# EAGLE schematic Tyr V4 (EAGLE 9.5.1)

## Sheet 1 of 3
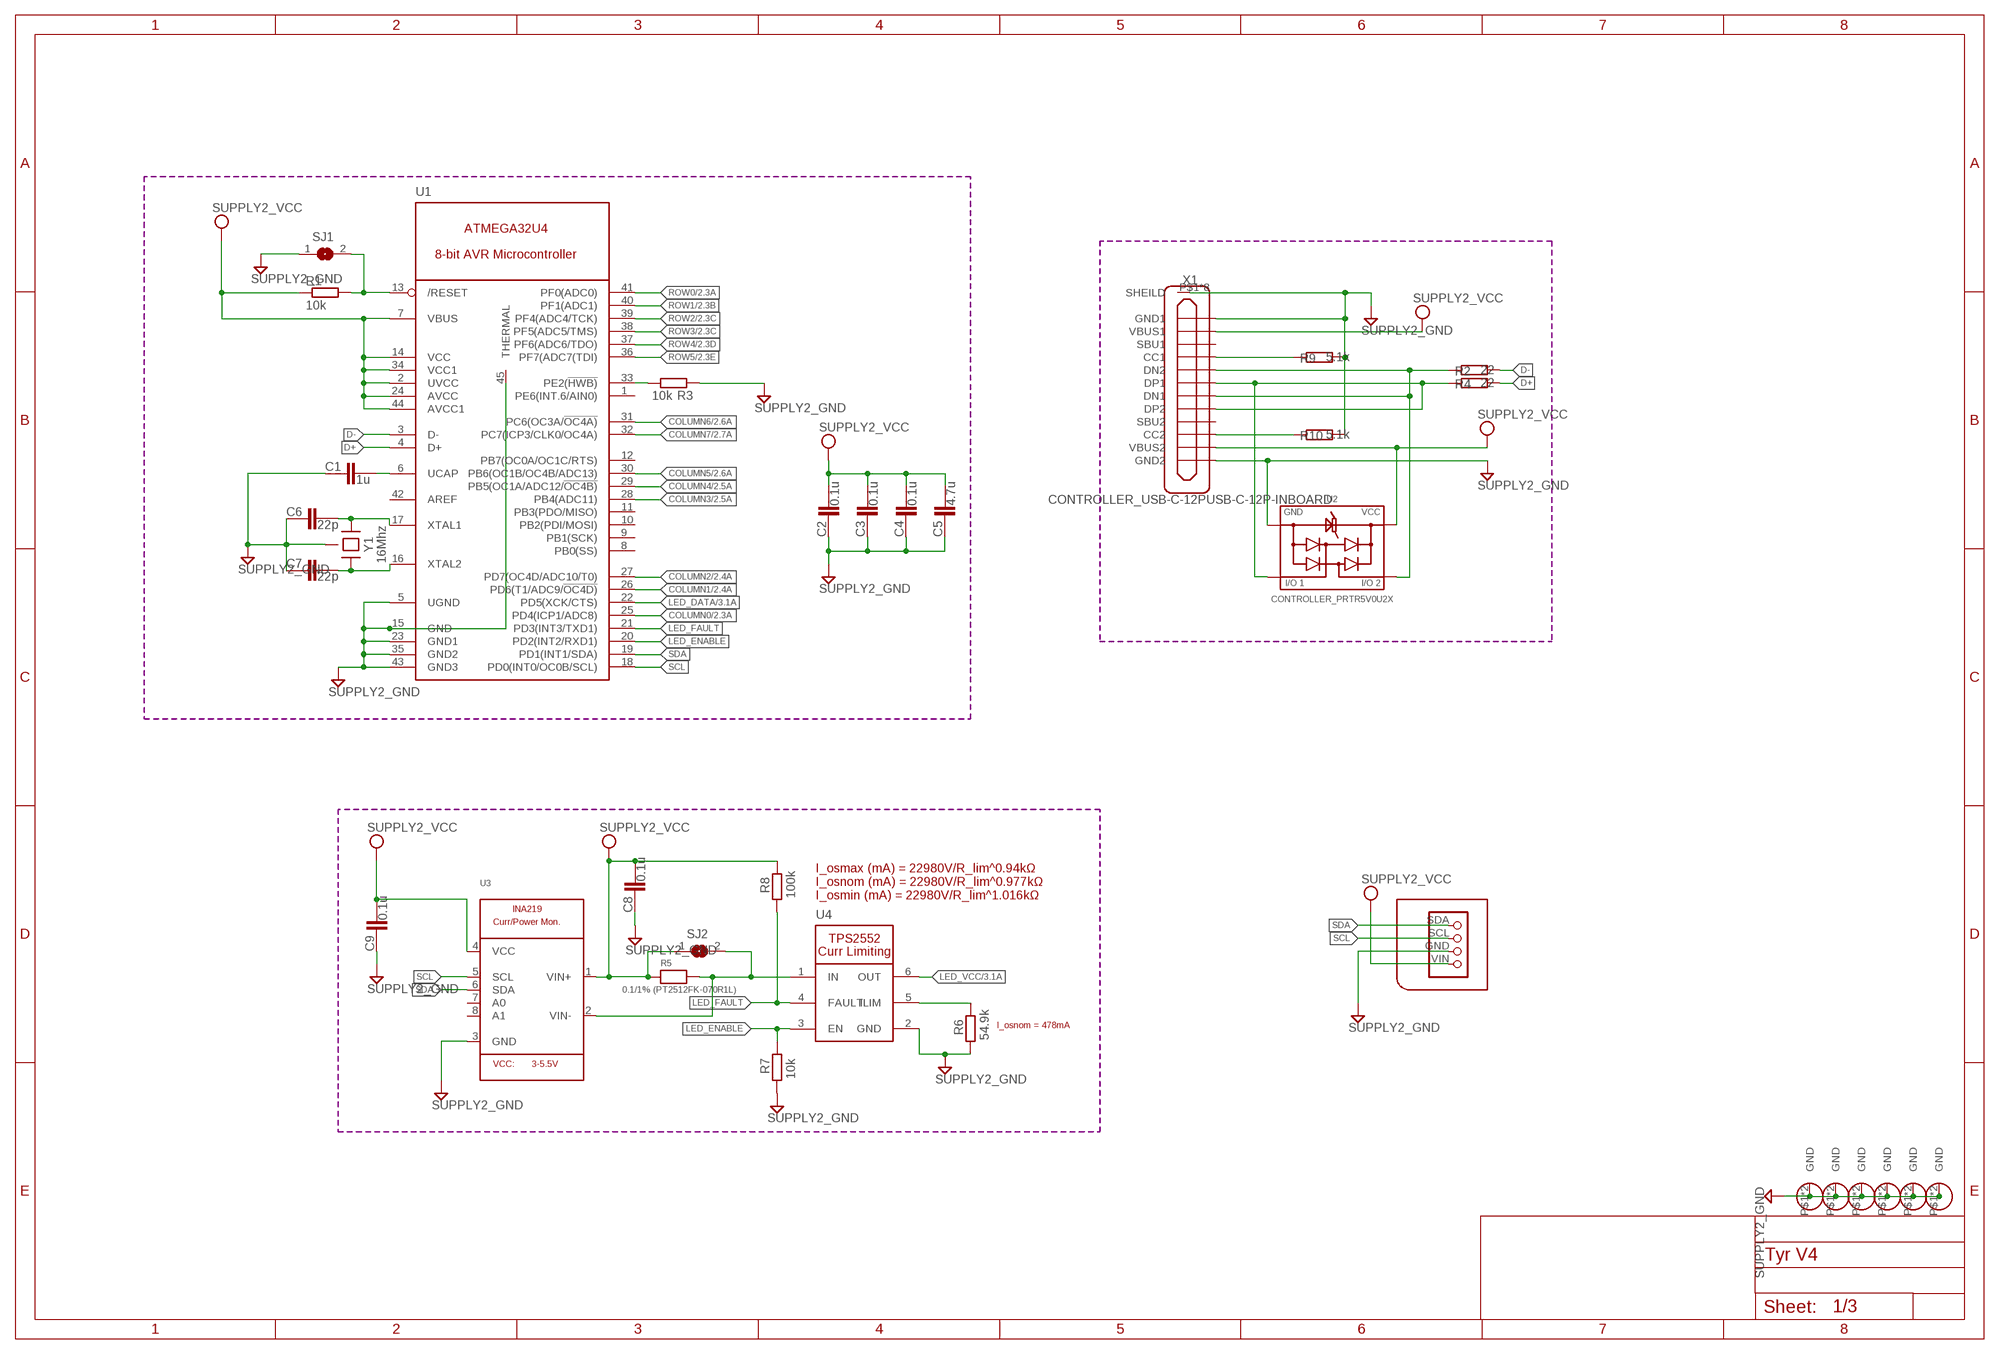
[diagram p0: schematic, sheet 1]

### Parts
C1  1u  COMPONENTS_CAPACITOR-0603  [COMPONENTS_C0603]
C2  0.1u  COMPONENTS_CAPACITOR-0603  [COMPONENTS_C0603]
C3  0.1u  COMPONENTS_CAPACITOR-0603  [COMPONENTS_C0603]
C4  0.1u  COMPONENTS_CAPACITOR-0603  [COMPONENTS_C0603]
C5  4.7u  COMPONENTS_CAPACITOR-0603  [COMPONENTS_C0603]
C6  22p  COMPONENTS_CAPACITOR-0603  [COMPONENTS_C0603]
C7  22p  COMPONENTS_CAPACITOR-0603  [COMPONENTS_C0603]
C8  0.1u  COMPONENTS_CAPACITOR-0603  [COMPONENTS_C0603]
C9  0.1u  COMPONENTS_CAPACITOR-0603  [COMPONENTS_C0603]
HOLE1  HOLE_MOUNT_HOLE  [HOLE_M3_OVAL]
HOLE2  HOLE_MOUNT_HOLE  [HOLE_M3_OVAL]
HOLE3  HOLE_MOUNT_HOLE  [HOLE_M3_OVAL]
HOLE4  HOLE_MOUNT_HOLE  [HOLE_M3_OVAL]
HOLE5  HOLE_MOUNT_HOLE  [HOLE_M3_OVAL]
HOLE6  HOLE_MOUNT_HOLE  [HOLE_M3_OVAL]
J1  TYR_TYR_DISPLAY  [TYR_TYR_DISPLAY]
R1  10k  COMPONENTS_RESISTOR-0603  [COMPONENTS_R0603]
R2  22  COMPONENTS_RESISTOR-0603  [COMPONENTS_R0603]
R3  10k  COMPONENTS_RESISTOR-0603  [COMPONENTS_R0603]
R4  22  COMPONENTS_RESISTOR-0603  [COMPONENTS_R0603]
R5  0.1/1% (PT2512FK-070R1L)  MICROBUILDER_RESISTOR2512  [MICROBUILDER_2512]
R6  54.9k  COMPONENTS_RESISTOR-0603  [COMPONENTS_R0603]
R7  10k  COMPONENTS_RESISTOR-0603  [COMPONENTS_R0603]
R8  100k  COMPONENTS_RESISTOR-0603  [COMPONENTS_R0603]
R9  5.1k  COMPONENTS_RESISTOR-0603  [COMPONENTS_R0603]
R10  5.1k  COMPONENTS_RESISTOR-0603  [COMPONENTS_R0603]
SJ1  MICROBUILDER_SOLDERJUMPER  [MICROBUILDER_SOLDERJUMPER_ARROW_NOPASTE]
SJ2  MICROBUILDER_SOLDERJUMPER  [MICROBUILDER_SOLDERJUMPER_ARROW_NOPASTE]
U1  TYR_ATMEGA32U4  [TYR_QFN44-7X7]
U2  CONTROLLER_PRTR5V0U2X  [CONTROLLER_PRTR5V0U2X]
U3  MICROBUILDER_INA219  [MICROBUILDER_SOT23-8]
U4  TYR_TPS2552  [TYR_SOT-23-6P]
X1  CONTROLLER_USB-C-12PUSB-C-12P-INBOARD  [CONTROLLER_USB-C-12P-INBOARD]
Y1  16Mhz  CONTROLLER_CRYSTAL-4PIN-3.2X2.5  [CONTROLLER_CRYSTAL-3.2X2.5]

### Nets
COLUMN0: U1.25(PD4(ICP1/ADC8)) ; also sheet 2
COLUMN1: U1.26(PD6(T1/ADC9/!OC4D)) ; also sheet 2
COLUMN2: U1.27(PD7(OC4D/ADC10/T0)) ; also sheet 2
COLUMN3: U1.28(PB4(ADC11)) ; also sheet 2
COLUMN4: U1.29(PB5(OC1A/ADC12/!OC4B)) ; also sheet 2
COLUMN5: U1.30(PB6(OC1B/OC4B/ADC13)) ; also sheet 2
COLUMN6: U1.31(PC6(OC3A/!OC4A)) ; also sheet 2
COLUMN7: U1.32(PC7(ICP3/CLK0/OC4A)) ; also sheet 2
D+: R4.2 U1.4(D+)
D-: R2.2 U1.3(D-)
GND: C1.1 C2.1 C3.1 C4.1 C5.1 C6.1 C7.1 C8.1 C9.1 HOLE1.P$1(GND) HOLE1.P$2(GND) HOLE2.P$1(GND) HOLE2.P$2(GND) HOLE3.P$1(GND) HOLE3.P$2(GND) HOLE4.P$1(GND) HOLE4.P$2(GND) HOLE5.P$1(GND) HOLE5.P$2(GND) HOLE6.P$1(GND) HOLE6.P$2(GND) J1.GND R3.1 R6.1 R7.1 R9.2 R10.2 SJ1.1 U1.5(UGND) U1.15(GND) U1.23(GND1) U1.35(GND2) U1.43(GND3) U1.45(THERMAL) U2.1 U3.3(GND) U4.2(GND) X1.GND1 X1.GND2 X1.P$1(SHEILD) X1.P$2(SHEILD) X1.P$3(SHEILD) X1.P$4(SHEILD) X1.P$5(SHEILD) X1.P$6(SHEILD) X1.P$8(SHEILD) X1.P$9(SHEILD) Y1.2(GND) Y1.4(GND) ; supply symbol labelled SUPPLY2_GND ; also sheet 2,3
LED_DATA: U1.22(PD5(XCK/CTS)) ; also sheet 3
LED_ENABLE: R7.2 U1.20(PD2(INT2/RXD1)) U4.3(EN)
LED_FAULT: R8.1 U1.21(PD3(INT3/TXD1)) U4.4(FAULT)
LED_VCC: U4.6(OUT) ; also sheet 3
N$2: R5.2 SJ2.2 U3.2(VIN-) U4.1(IN)
N$3: R6.2 U4.5(ILIM)
N$4: R9.1 X1.CC1
N$5: R3.2 U1.33(PE2(!HWB))
N$6: R2.1 U2.3 X1.DN1 X1.DN2
N$7: R4.1 U2.2 X1.DP1 X1.DP2
N$8: C1.2 U1.6(UCAP)
N$89: R10.1 X1.CC2
RESET: R1.2 SJ1.2 U1.13(/RESET)
ROW0: U1.41(PF0(ADC0)) ; also sheet 2
ROW1: U1.40(PF1(ADC1)) ; also sheet 2
ROW2: U1.39(PF4(ADC4/TCK)) ; also sheet 2
ROW3: U1.38(PF5(ADC5/TMS)) ; also sheet 2
ROW4: U1.37(PF6(ADC6/TDO)) ; also sheet 2
ROW5: U1.36(PF7(ADC7(TDI)) ; also sheet 2
SCL: J1.SCL U1.18(PD0(INT0/OC0B/SCL)) U3.5(SCL)
SDA: J1.SDA U1.19(PD1(INT1/SDA)) U3.6(SDA)
VCC: C2.2 C3.2 C4.2 C5.2 C8.2 C9.2 J1.VIN R1.1 R5.1 R8.2 SJ2.1 U1.2(UVCC) U1.7(VBUS) U1.14(VCC) U1.24(AVCC) U1.34(VCC1) U1.44(AVCC1) U2.4 U3.1(VIN+) U3.4(VCC) X1.VBUS1 X1.VBUS2 ; supply symbol labelled SUPPLY2_VCC
XTAL1: C6.2 U1.17(XTAL1) Y1.1
XTAL2: C7.2 U1.16(XTAL2) Y1.3
Unconnected: U1.1(PE6(INT.6/AIN0)) U1.8(PB0(SS)) U1.9(PB1(SCK)) U1.10(PB2(PDI/MOSI)) U1.11(PB3(PDO/MISO)) U1.12(PB7(OC0A/OC1C/RTS)) U1.42(AREF) U3.7(A0) U3.8(A1) X1.SBU1 X1.SBU2

### Notes on the sheet
- I_osmax (mA) = 22980V/R_lim^0.94kΩ
  I_osnom (mA) = 22980V/R_lim^0.977kΩ
  I_osmin (mA) = 22980V/R_lim^1.016kΩ
- I_osnom = 478mA

## Sheet 2 of 3: Keysiwtch Matrix
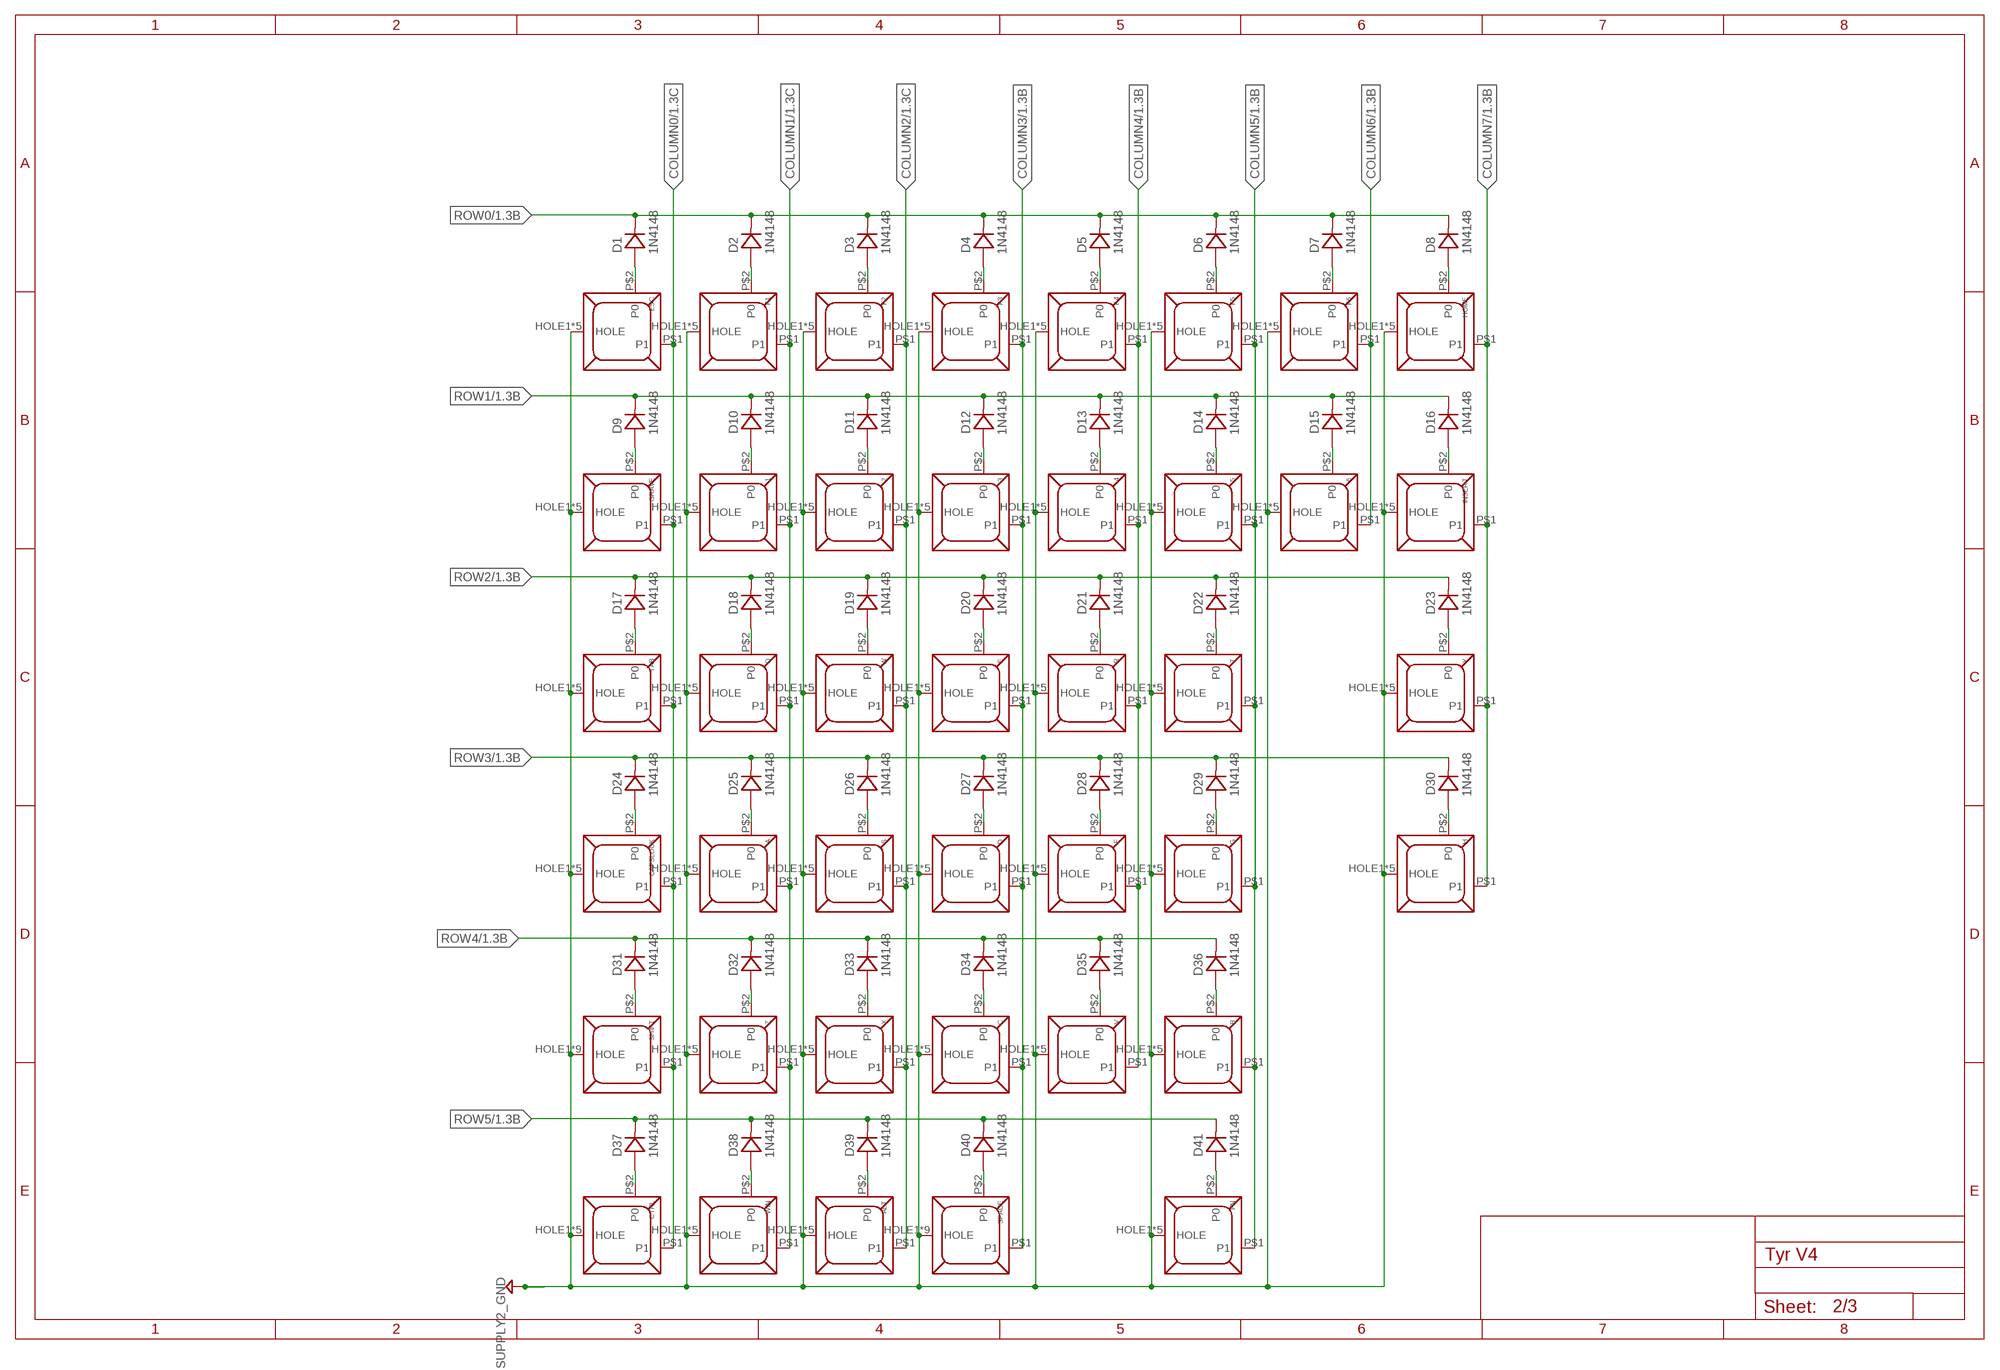
[diagram p1: schematic, sheet 2]

### Parts
1  KEYBOARD_KEYSWITCH-MX-1U-HOTSWAP  [KEYBOARD_MX-1U-HOTSWAP]
2  KEYBOARD_KEYSWITCH-MX-1U-HOTSWAP  [KEYBOARD_MX-1U-HOTSWAP]
3  KEYBOARD_KEYSWITCH-MX-1U-HOTSWAP  [KEYBOARD_MX-1U-HOTSWAP]
4  KEYBOARD_KEYSWITCH-MX-1U-HOTSWAP  [KEYBOARD_MX-1U-HOTSWAP]
5  KEYBOARD_KEYSWITCH-MX-1U-HOTSWAP  [KEYBOARD_MX-1U-HOTSWAP]
6  KEYBOARD_KEYSWITCH-MX-1U-HOTSWAP  [KEYBOARD_MX-1U-HOTSWAP]
A  KEYBOARD_KEYSWITCH-MX-1U-HOTSWAP  [KEYBOARD_MX-1U-HOTSWAP]
ALT  KEYBOARD_KEYSWITCH-MX-1U-HOTSWAP  [KEYBOARD_MX-1U-HOTSWAP]
B  KEYBOARD_KEYSWITCH-MX-1U-HOTSWAP  [KEYBOARD_MX-1U-HOTSWAP]
C  KEYBOARD_KEYSWITCH-MX-1U-HOTSWAP  [KEYBOARD_MX-1U-HOTSWAP]
CAPSLOCK  KEYBOARD_KEYSWITCH-MX-1U-HOTSWAPCAPSLOCK  [KEYBOARD_MX-1U-HOTSWAP-CAPSLOCK]
CTRL  KEYBOARD_KEYSWITCH-MX-1U-HOTSWAP  [KEYBOARD_MX-1U-HOTSWAP]
D  KEYBOARD_KEYSWITCH-MX-1U-HOTSWAP  [KEYBOARD_MX-1U-HOTSWAP]
D1  1N4148  COMPONENTS_DIODE-SOD-123  [COMPONENTS_SOD-123]
D2  1N4148  COMPONENTS_DIODE-SOD-123  [COMPONENTS_SOD-123]
D3  1N4148  COMPONENTS_DIODE-SOD-123  [COMPONENTS_SOD-123]
D4  1N4148  COMPONENTS_DIODE-SOD-123  [COMPONENTS_SOD-123]
D5  1N4148  COMPONENTS_DIODE-SOD-123  [COMPONENTS_SOD-123]
D6  1N4148  COMPONENTS_DIODE-SOD-123  [COMPONENTS_SOD-123]
D7  1N4148  COMPONENTS_DIODE-SOD-123  [COMPONENTS_SOD-123]
D8  1N4148  COMPONENTS_DIODE-SOD-123  [COMPONENTS_SOD-123]
D9  1N4148  COMPONENTS_DIODE-SOD-123  [COMPONENTS_SOD-123]
D10  1N4148  COMPONENTS_DIODE-SOD-123  [COMPONENTS_SOD-123]
D11  1N4148  COMPONENTS_DIODE-SOD-123  [COMPONENTS_SOD-123]
D12  1N4148  COMPONENTS_DIODE-SOD-123  [COMPONENTS_SOD-123]
D13  1N4148  COMPONENTS_DIODE-SOD-123  [COMPONENTS_SOD-123]
D14  1N4148  COMPONENTS_DIODE-SOD-123  [COMPONENTS_SOD-123]
D15  1N4148  COMPONENTS_DIODE-SOD-123  [COMPONENTS_SOD-123]
D16  1N4148  COMPONENTS_DIODE-SOD-123  [COMPONENTS_SOD-123]
D17  1N4148  COMPONENTS_DIODE-SOD-123  [COMPONENTS_SOD-123]
D18  1N4148  COMPONENTS_DIODE-SOD-123  [COMPONENTS_SOD-123]
D19  1N4148  COMPONENTS_DIODE-SOD-123  [COMPONENTS_SOD-123]
D20  1N4148  COMPONENTS_DIODE-SOD-123  [COMPONENTS_SOD-123]
D21  1N4148  COMPONENTS_DIODE-SOD-123  [COMPONENTS_SOD-123]
D22  1N4148  COMPONENTS_DIODE-SOD-123  [COMPONENTS_SOD-123]
D23  1N4148  COMPONENTS_DIODE-SOD-123  [COMPONENTS_SOD-123]
D24  1N4148  COMPONENTS_DIODE-SOD-123  [COMPONENTS_SOD-123]
D25  1N4148  COMPONENTS_DIODE-SOD-123  [COMPONENTS_SOD-123]
D26  1N4148  COMPONENTS_DIODE-SOD-123  [COMPONENTS_SOD-123]
D27  1N4148  COMPONENTS_DIODE-SOD-123  [COMPONENTS_SOD-123]
D28  1N4148  COMPONENTS_DIODE-SOD-123  [COMPONENTS_SOD-123]
D29  1N4148  COMPONENTS_DIODE-SOD-123  [COMPONENTS_SOD-123]
D30  1N4148  COMPONENTS_DIODE-SOD-123  [COMPONENTS_SOD-123]
D31  1N4148  COMPONENTS_DIODE-SOD-123  [COMPONENTS_SOD-123]
D32  1N4148  COMPONENTS_DIODE-SOD-123  [COMPONENTS_SOD-123]
D33  1N4148  COMPONENTS_DIODE-SOD-123  [COMPONENTS_SOD-123]
D34  1N4148  COMPONENTS_DIODE-SOD-123  [COMPONENTS_SOD-123]
D35  1N4148  COMPONENTS_DIODE-SOD-123  [COMPONENTS_SOD-123]
D36  1N4148  COMPONENTS_DIODE-SOD-123  [COMPONENTS_SOD-123]
D37  1N4148  COMPONENTS_DIODE-SOD-123  [COMPONENTS_SOD-123]
D38  1N4148  COMPONENTS_DIODE-SOD-123  [COMPONENTS_SOD-123]
D39  1N4148  COMPONENTS_DIODE-SOD-123  [COMPONENTS_SOD-123]
D40  1N4148  COMPONENTS_DIODE-SOD-123  [COMPONENTS_SOD-123]
D41  1N4148  COMPONENTS_DIODE-SOD-123  [COMPONENTS_SOD-123]
E  KEYBOARD_KEYSWITCH-MX-1U-HOTSWAP  [KEYBOARD_MX-1U-HOTSWAP]
ESC  KEYBOARD_KEYSWITCH-MX-1U-HOTSWAP  [KEYBOARD_MX-1U-HOTSWAP]
F  KEYBOARD_KEYSWITCH-MX-1U-HOTSWAP  [KEYBOARD_MX-1U-HOTSWAP]
F1  KEYBOARD_KEYSWITCH-MX-1U-HOTSWAP  [KEYBOARD_MX-1U-HOTSWAP]
F2  KEYBOARD_KEYSWITCH-MX-1U-HOTSWAP  [KEYBOARD_MX-1U-HOTSWAP]
F3  KEYBOARD_KEYSWITCH-MX-1U-HOTSWAP  [KEYBOARD_MX-1U-HOTSWAP]
F4  KEYBOARD_KEYSWITCH-MX-1U-HOTSWAP  [KEYBOARD_MX-1U-HOTSWAP]
F5  KEYBOARD_KEYSWITCH-MX-1U-HOTSWAP  [KEYBOARD_MX-1U-HOTSWAP]
F6  KEYBOARD_KEYSWITCH-MX-1U-HOTSWAP  [KEYBOARD_MX-1U-HOTSWAP]
FN  KEYBOARD_KEYSWITCH-MX-1U-HOTSWAP  [KEYBOARD_MX-1U-HOTSWAP]
G  KEYBOARD_KEYSWITCH-MX-1U-HOTSWAP  [KEYBOARD_MX-1U-HOTSWAP]
GRAVE  KEYBOARD_KEYSWITCH-MX-1U-HOTSWAP  [KEYBOARD_MX-1U-HOTSWAP]
H  KEYBOARD_KEYSWITCH-MX-1U-HOTSWAP  [KEYBOARD_MX-1U-HOTSWAP]
HOME  KEYBOARD_KEYSWITCH-MX-1U-HOTSWAP  [KEYBOARD_MX-1U-HOTSWAP]
INSERT  KEYBOARD_KEYSWITCH-MX-1U-HOTSWAP  [KEYBOARD_MX-1U-HOTSWAP]
Q  KEYBOARD_KEYSWITCH-MX-1U-HOTSWAP  [KEYBOARD_MX-1U-HOTSWAP]
R  KEYBOARD_KEYSWITCH-MX-1U-HOTSWAP  [KEYBOARD_MX-1U-HOTSWAP]
S  KEYBOARD_KEYSWITCH-MX-1U-HOTSWAP  [KEYBOARD_MX-1U-HOTSWAP]
SHIFT  KEYBOARD_KEYSWITCH-MX-2U-HOTSWAP  [KEYBOARD_MX-2U-HOTSWAP]
SPACE  KEYBOARD_KEYSWITCH-MX-2U-HOTSWAP  [KEYBOARD_MX-2U-HOTSWAP]
T  KEYBOARD_KEYSWITCH-MX-1U-HOTSWAP  [KEYBOARD_MX-1U-HOTSWAP]
TAB  KEYBOARD_KEYSWITCH-MX-1U-HOTSWAP  [KEYBOARD_MX-1U-HOTSWAP]
V  KEYBOARD_KEYSWITCH-MX-1U-HOTSWAP  [KEYBOARD_MX-1U-HOTSWAP]
W  KEYBOARD_KEYSWITCH-MX-1U-HOTSWAP  [KEYBOARD_MX-1U-HOTSWAP]
WIN  KEYBOARD_KEYSWITCH-MX-1U-HOTSWAP  [KEYBOARD_MX-1U-HOTSWAP]
X  KEYBOARD_KEYSWITCH-MX-1U-HOTSWAP  [KEYBOARD_MX-1U-HOTSWAP]
Y  KEYBOARD_KEYSWITCH-MX-1U-HOTSWAP  [KEYBOARD_MX-1U-HOTSWAP]
Z  KEYBOARD_KEYSWITCH-MX-1U-HOTSWAP  [KEYBOARD_MX-1U-HOTSWAP]

### Nets
COLUMN0: CAPSLOCK.P$1(P1) CTRL.P$1(P1) ESC.P$1(P1) GRAVE.P$1(P1) SHIFT.P$1(P1) TAB.P$1(P1) ; also sheet 1
COLUMN1: 1.P$1(P1) A.P$1(P1) F1.P$1(P1) Q.P$1(P1) WIN.P$1(P1) Z.P$1(P1) ; also sheet 1
COLUMN2: 2.P$1(P1) ALT.P$1(P1) F2.P$1(P1) S.P$1(P1) W.P$1(P1) X.P$1(P1) ; also sheet 1
COLUMN3: 3.P$1(P1) C.P$1(P1) D.P$1(P1) E.P$1(P1) F3.P$1(P1) SPACE.P$1(P1) ; also sheet 1
COLUMN4: 4.P$1(P1) F4.P$1(P1) F.P$1(P1) R.P$1(P1) V.P$1(P1) ; also sheet 1
COLUMN5: 5.P$1(P1) B.P$1(P1) F5.P$1(P1) FN.P$1(P1) G.P$1(P1) T.P$1(P1) ; also sheet 1
COLUMN6: 6.P$1(P1) F6.P$1(P1) ; also sheet 1
COLUMN7: H.P$1(P1) HOME.P$1(P1) INSERT.P$1(P1) Y.P$1(P1) ; also sheet 1
GND: 1.HOLE1(HOLE) 1.HOLE2(HOLE) 1.HOLE3(HOLE) 1.HOLE4(HOLE) 1.HOLE5(HOLE) 2.HOLE1(HOLE) 2.HOLE2(HOLE) 2.HOLE3(HOLE) 2.HOLE4(HOLE) 2.HOLE5(HOLE) 3.HOLE1(HOLE) 3.HOLE2(HOLE) 3.HOLE3(HOLE) 3.HOLE4(HOLE) 3.HOLE5(HOLE) 4.HOLE1(HOLE) 4.HOLE2(HOLE) 4.HOLE3(HOLE) 4.HOLE4(HOLE) 4.HOLE5(HOLE) 5.HOLE1(HOLE) 5.HOLE2(HOLE) 5.HOLE3(HOLE) 5.HOLE4(HOLE) 5.HOLE5(HOLE) 6.HOLE1(HOLE) 6.HOLE2(HOLE) 6.HOLE3(HOLE) 6.HOLE4(HOLE) 6.HOLE5(HOLE) A.HOLE1(HOLE) A.HOLE2(HOLE) A.HOLE3(HOLE) A.HOLE4(HOLE) A.HOLE5(HOLE) ALT.HOLE1(HOLE) ALT.HOLE2(HOLE) ALT.HOLE3(HOLE) ALT.HOLE4(HOLE) ALT.HOLE5(HOLE) B.HOLE1(HOLE) B.HOLE2(HOLE) B.HOLE3(HOLE) B.HOLE4(HOLE) B.HOLE5(HOLE) C.HOLE1(HOLE) C.HOLE2(HOLE) C.HOLE3(HOLE) C.HOLE4(HOLE) C.HOLE5(HOLE) CAPSLOCK.HOLE1(HOLE) CAPSLOCK.HOLE2(HOLE) CAPSLOCK.HOLE3(HOLE) CAPSLOCK.HOLE4(HOLE) CAPSLOCK.HOLE5(HOLE) CTRL.HOLE1(HOLE) CTRL.HOLE2(HOLE) CTRL.HOLE3(HOLE) CTRL.HOLE4(HOLE) CTRL.HOLE5(HOLE) D.HOLE1(HOLE) D.HOLE2(HOLE) D.HOLE3(HOLE) D.HOLE4(HOLE) D.HOLE5(HOLE) E.HOLE1(HOLE) E.HOLE2(HOLE) E.HOLE3(HOLE) E.HOLE4(HOLE) E.HOLE5(HOLE) ESC.HOLE1(HOLE) ESC.HOLE2(HOLE) ESC.HOLE3(HOLE) ESC.HOLE4(HOLE) ESC.HOLE5(HOLE) F1.HOLE1(HOLE) F1.HOLE2(HOLE) F1.HOLE3(HOLE) F1.HOLE4(HOLE) F1.HOLE5(HOLE) F2.HOLE1(HOLE) F2.HOLE2(HOLE) F2.HOLE3(HOLE) F2.HOLE4(HOLE) F2.HOLE5(HOLE) F3.HOLE1(HOLE) F3.HOLE2(HOLE) F3.HOLE3(HOLE) F3.HOLE4(HOLE) F3.HOLE5(HOLE) F4.HOLE1(HOLE) F4.HOLE2(HOLE) F4.HOLE3(HOLE) F4.HOLE4(HOLE) F4.HOLE5(HOLE) F5.HOLE1(HOLE) F5.HOLE2(HOLE) F5.HOLE3(HOLE) F5.HOLE4(HOLE) F5.HOLE5(HOLE) F6.HOLE1(HOLE) F6.HOLE2(HOLE) F6.HOLE3(HOLE) F6.HOLE4(HOLE) F6.HOLE5(HOLE) F.HOLE1(HOLE) F.HOLE2(HOLE) F.HOLE3(HOLE) F.HOLE4(HOLE) F.HOLE5(HOLE) FN.HOLE1(HOLE) FN.HOLE2(HOLE) FN.HOLE3(HOLE) FN.HOLE4(HOLE) FN.HOLE5(HOLE) G.HOLE1(HOLE) G.HOLE2(HOLE) G.HOLE3(HOLE) G.HOLE4(HOLE) G.HOLE5(HOLE) GRAVE.HOLE1(HOLE) GRAVE.HOLE2(HOLE) GRAVE.HOLE3(HOLE) GRAVE.HOLE4(HOLE) GRAVE.HOLE5(HOLE) H.HOLE1(HOLE) H.HOLE2(HOLE) H.HOLE3(HOLE) H.HOLE4(HOLE) H.HOLE5(HOLE) HOME.HOLE1(HOLE) HOME.HOLE2(HOLE) HOME.HOLE3(HOLE) HOME.HOLE4(HOLE) HOME.HOLE5(HOLE) INSERT.HOLE1(HOLE) INSERT.HOLE2(HOLE) INSERT.HOLE3(HOLE) INSERT.HOLE4(HOLE) INSERT.HOLE5(HOLE) Q.HOLE1(HOLE) Q.HOLE2(HOLE) Q.HOLE3(HOLE) Q.HOLE4(HOLE) Q.HOLE5(HOLE) R.HOLE1(HOLE) R.HOLE2(HOLE) R.HOLE3(HOLE) R.HOLE4(HOLE) R.HOLE5(HOLE) S.HOLE1(HOLE) S.HOLE2(HOLE) S.HOLE3(HOLE) S.HOLE4(HOLE) S.HOLE5(HOLE) SHIFT.HOLE1(HOLE) SHIFT.HOLE2(HOLE) SHIFT.HOLE3(HOLE) SHIFT.HOLE4(HOLE) SHIFT.HOLE5(HOLE) SHIFT.HOLE6(HOLE) SHIFT.HOLE7(HOLE) SHIFT.HOLE8(HOLE) SHIFT.HOLE9(HOLE) SPACE.HOLE1(HOLE) SPACE.HOLE2(HOLE) SPACE.HOLE3(HOLE) SPACE.HOLE4(HOLE) SPACE.HOLE5(HOLE) SPACE.HOLE6(HOLE) SPACE.HOLE7(HOLE) SPACE.HOLE8(HOLE) SPACE.HOLE9(HOLE) T.HOLE1(HOLE) T.HOLE2(HOLE) T.HOLE3(HOLE) T.HOLE4(HOLE) T.HOLE5(HOLE) TAB.HOLE1(HOLE) TAB.HOLE2(HOLE) TAB.HOLE3(HOLE) TAB.HOLE4(HOLE) TAB.HOLE5(HOLE) V.HOLE1(HOLE) V.HOLE2(HOLE) V.HOLE3(HOLE) V.HOLE4(HOLE) V.HOLE5(HOLE) W.HOLE1(HOLE) W.HOLE2(HOLE) W.HOLE3(HOLE) W.HOLE4(HOLE) W.HOLE5(HOLE) WIN.HOLE1(HOLE) WIN.HOLE2(HOLE) WIN.HOLE3(HOLE) WIN.HOLE4(HOLE) WIN.HOLE5(HOLE) X.HOLE1(HOLE) X.HOLE2(HOLE) X.HOLE3(HOLE) X.HOLE4(HOLE) X.HOLE5(HOLE) Y.HOLE1(HOLE) Y.HOLE2(HOLE) Y.HOLE3(HOLE) Y.HOLE4(HOLE) Y.HOLE5(HOLE) Z.HOLE1(HOLE) Z.HOLE2(HOLE) Z.HOLE3(HOLE) Z.HOLE4(HOLE) Z.HOLE5(HOLE) ; supply symbol labelled SUPPLY2_GND ; also sheet 1,3
N$1: 1.P$2(P0) D10.A
N$10: D1.A ESC.P$2(P0)
N$11: D2.A F1.P$2(P0)
N$12: D3.A F2.P$2(P0)
N$13: D4.A F3.P$2(P0)
N$14: D5.A F4.P$2(P0)
N$15: D6.A F5.P$2(P0)
N$16: D7.A F6.P$2(P0)
N$17: D8.A HOME.P$2(P0)
N$18: D16.A INSERT.P$2(P0)
N$19: 6.P$2(P0) D15.A
N$20: 5.P$2(P0) D14.A
N$21: 4.P$2(P0) D13.A
N$22: 3.P$2(P0) D12.A
N$23: 2.P$2(P0) D11.A
N$24: D9.A GRAVE.P$2(P0)
N$25: D23.A Y.P$2(P0)
N$26: D22.A T.P$2(P0)
N$27: D21.A R.P$2(P0)
N$28: D20.A E.P$2(P0)
N$29: D19.A W.P$2(P0)
N$31: D17.A TAB.P$2(P0)
N$32: CAPSLOCK.P$2(P0) D24.A
N$33: A.P$2(P0) D25.A
N$34: D26.A S.P$2(P0)
N$35: D27.A D.P$2(P0)
N$36: D28.A F.P$2(P0)
N$37: D29.A G.P$2(P0)
N$38: D30.A H.P$2(P0)
N$39: B.P$2(P0) D36.A
N$40: C.P$2(P0) D34.A
N$41: D33.A X.P$2(P0)
N$42: D32.A Z.P$2(P0)
N$43: D31.A SHIFT.P$2(P0)
N$44: CTRL.P$2(P0) D37.A
N$45: D38.A WIN.P$2(P0)
N$46: ALT.P$2(P0) D39.A
N$47: D40.A SPACE.P$2(P0)
N$48: D41.A FN.P$2(P0)
N$49: D35.A V.P$2(P0)
N$50: D18.A Q.P$2(P0)
ROW0: D1.C D2.C D3.C D4.C D5.C D6.C D7.C D8.C ; also sheet 1
ROW1: D9.C D10.C D11.C D12.C D13.C D14.C D15.C D16.C ; also sheet 1
ROW2: D17.C D18.C D19.C D20.C D21.C D22.C D23.C ; also sheet 1
ROW3: D24.C D25.C D26.C D27.C D28.C D29.C D30.C ; also sheet 1
ROW4: D31.C D32.C D33.C D34.C D35.C D36.C ; also sheet 1
ROW5: D37.C D38.C D39.C D40.C D41.C ; also sheet 1

## Sheet 3 of 3: RGB Matrix
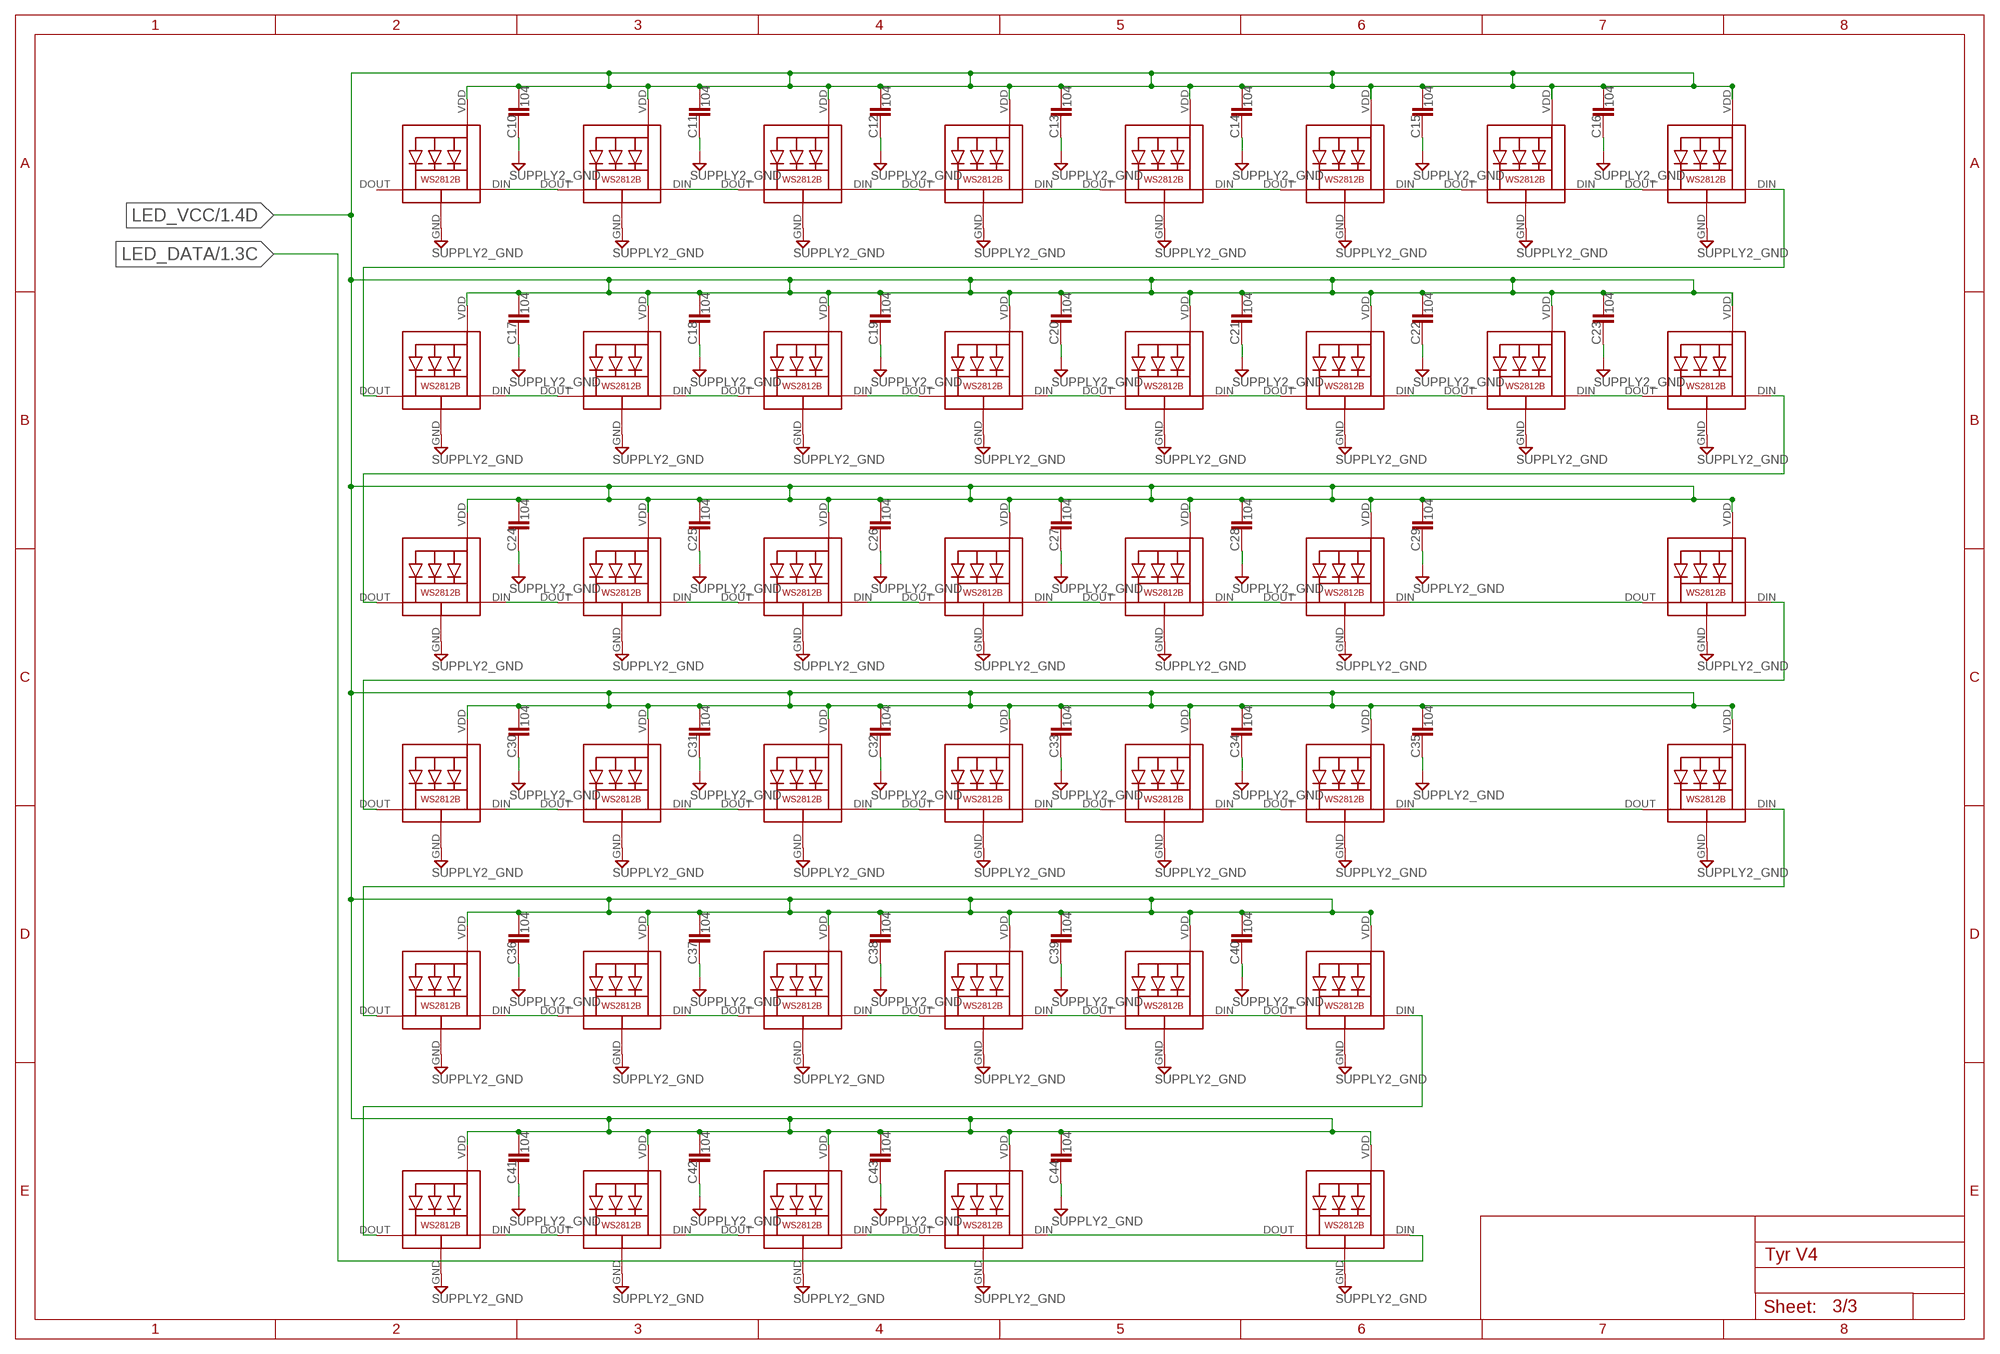
[diagram p2: schematic, sheet 3]

### Parts
C10  104  COMPONENTS_CAPACITOR-0603  [COMPONENTS_C0603]
C11  104  COMPONENTS_CAPACITOR-0603  [COMPONENTS_C0603]
C12  104  COMPONENTS_CAPACITOR-0603  [COMPONENTS_C0603]
C13  104  COMPONENTS_CAPACITOR-0603  [COMPONENTS_C0603]
C14  104  COMPONENTS_CAPACITOR-0603  [COMPONENTS_C0603]
C15  104  COMPONENTS_CAPACITOR-0603  [COMPONENTS_C0603]
C16  104  COMPONENTS_CAPACITOR-0603  [COMPONENTS_C0603]
C17  104  COMPONENTS_CAPACITOR-0603  [COMPONENTS_C0603]
C18  104  COMPONENTS_CAPACITOR-0603  [COMPONENTS_C0603]
C19  104  COMPONENTS_CAPACITOR-0603  [COMPONENTS_C0603]
C20  104  COMPONENTS_CAPACITOR-0603  [COMPONENTS_C0603]
C21  104  COMPONENTS_CAPACITOR-0603  [COMPONENTS_C0603]
C22  104  COMPONENTS_CAPACITOR-0603  [COMPONENTS_C0603]
C23  104  COMPONENTS_CAPACITOR-0603  [COMPONENTS_C0603]
C24  104  COMPONENTS_CAPACITOR-0603  [COMPONENTS_C0603]
C25  104  COMPONENTS_CAPACITOR-0603  [COMPONENTS_C0603]
C26  104  COMPONENTS_CAPACITOR-0603  [COMPONENTS_C0603]
C27  104  COMPONENTS_CAPACITOR-0603  [COMPONENTS_C0603]
C28  104  COMPONENTS_CAPACITOR-0603  [COMPONENTS_C0603]
C29  104  COMPONENTS_CAPACITOR-0603  [COMPONENTS_C0603]
C30  104  COMPONENTS_CAPACITOR-0603  [COMPONENTS_C0603]
C31  104  COMPONENTS_CAPACITOR-0603  [COMPONENTS_C0603]
C32  104  COMPONENTS_CAPACITOR-0603  [COMPONENTS_C0603]
C33  104  COMPONENTS_CAPACITOR-0603  [COMPONENTS_C0603]
C34  104  COMPONENTS_CAPACITOR-0603  [COMPONENTS_C0603]
C35  104  COMPONENTS_CAPACITOR-0603  [COMPONENTS_C0603]
C36  104  COMPONENTS_CAPACITOR-0603  [COMPONENTS_C0603]
C37  104  COMPONENTS_CAPACITOR-0603  [COMPONENTS_C0603]
C38  104  COMPONENTS_CAPACITOR-0603  [COMPONENTS_C0603]
C39  104  COMPONENTS_CAPACITOR-0603  [COMPONENTS_C0603]
C40  104  COMPONENTS_CAPACITOR-0603  [COMPONENTS_C0603]
C41  104  COMPONENTS_CAPACITOR-0603  [COMPONENTS_C0603]
C42  104  COMPONENTS_CAPACITOR-0603  [COMPONENTS_C0603]
C43  104  COMPONENTS_CAPACITOR-0603  [COMPONENTS_C0603]
C44  104  COMPONENTS_CAPACITOR-0603  [COMPONENTS_C0603]
LED1  TYR_WS2812B_3528_REVERS-MOUNT  [TYR_WS2812B_3528_REVERS-MOUNT]
LED2  TYR_WS2812B_3528_REVERS-MOUNT  [TYR_WS2812B_3528_REVERS-MOUNT]
LED3  TYR_WS2812B_3528_REVERS-MOUNT  [TYR_WS2812B_3528_REVERS-MOUNT]
LED4  TYR_WS2812B_3528_REVERS-MOUNT  [TYR_WS2812B_3528_REVERS-MOUNT]
LED5  TYR_WS2812B_3528_REVERS-MOUNT  [TYR_WS2812B_3528_REVERS-MOUNT]
LED6  TYR_WS2812B_3528_REVERS-MOUNT  [TYR_WS2812B_3528_REVERS-MOUNT]
LED7  TYR_WS2812B_3528_REVERS-MOUNT  [TYR_WS2812B_3528_REVERS-MOUNT]
LED8  TYR_WS2812B_3528_REVERS-MOUNT  [TYR_WS2812B_3528_REVERS-MOUNT]
LED9  TYR_WS2812B_3528_REVERS-MOUNT  [TYR_WS2812B_3528_REVERS-MOUNT]
LED10  TYR_WS2812B_3528_REVERS-MOUNT  [TYR_WS2812B_3528_REVERS-MOUNT]
LED11  TYR_WS2812B_3528_REVERS-MOUNT  [TYR_WS2812B_3528_REVERS-MOUNT]
LED12  TYR_WS2812B_3528_REVERS-MOUNT  [TYR_WS2812B_3528_REVERS-MOUNT]
LED13  TYR_WS2812B_3528_REVERS-MOUNT  [TYR_WS2812B_3528_REVERS-MOUNT]
LED14  TYR_WS2812B_3528_REVERS-MOUNT  [TYR_WS2812B_3528_REVERS-MOUNT]
LED15  TYR_WS2812B_3528_REVERS-MOUNT  [TYR_WS2812B_3528_REVERS-MOUNT]
LED16  TYR_WS2812B_3528_REVERS-MOUNT  [TYR_WS2812B_3528_REVERS-MOUNT]
LED17  TYR_WS2812B_3528_REVERS-MOUNT  [TYR_WS2812B_3528_REVERS-MOUNT]
LED18  TYR_WS2812B_3528_REVERS-MOUNT  [TYR_WS2812B_3528_REVERS-MOUNT]
LED19  TYR_WS2812B_3528_REVERS-MOUNT  [TYR_WS2812B_3528_REVERS-MOUNT]
LED20  TYR_WS2812B_3528_REVERS-MOUNT  [TYR_WS2812B_3528_REVERS-MOUNT]
LED21  TYR_WS2812B_3528_REVERS-MOUNT  [TYR_WS2812B_3528_REVERS-MOUNT]
LED22  TYR_WS2812B_3528_REVERS-MOUNT  [TYR_WS2812B_3528_REVERS-MOUNT]
LED23  TYR_WS2812B_3528_REVERS-MOUNT  [TYR_WS2812B_3528_REVERS-MOUNT]
LED24  TYR_WS2812B_3528_REVERS-MOUNT  [TYR_WS2812B_3528_REVERS-MOUNT]
LED25  TYR_WS2812B_3528_REVERS-MOUNT  [TYR_WS2812B_3528_REVERS-MOUNT]
LED26  TYR_WS2812B_3528_REVERS-MOUNT  [TYR_WS2812B_3528_REVERS-MOUNT]
LED27  TYR_WS2812B_3528_REVERS-MOUNT  [TYR_WS2812B_3528_REVERS-MOUNT]
LED28  TYR_WS2812B_3528_REVERS-MOUNT  [TYR_WS2812B_3528_REVERS-MOUNT]
LED29  TYR_WS2812B_3528_REVERS-MOUNT  [TYR_WS2812B_3528_REVERS-MOUNT]
LED30  TYR_WS2812B_3528_REVERS-MOUNT  [TYR_WS2812B_3528_REVERS-MOUNT]
LED31  TYR_WS2812B_3528_REVERS-MOUNT  [TYR_WS2812B_3528_REVERS-MOUNT]
LED32  TYR_WS2812B_3528_REVERS-MOUNT  [TYR_WS2812B_3528_REVERS-MOUNT]
LED33  TYR_WS2812B_3528_REVERS-MOUNT  [TYR_WS2812B_3528_REVERS-MOUNT]
LED34  TYR_WS2812B_3528_REVERS-MOUNT  [TYR_WS2812B_3528_REVERS-MOUNT]
LED35  TYR_WS2812B_3528_REVERS-MOUNT  [TYR_WS2812B_3528_REVERS-MOUNT]
LED36  TYR_WS2812B_3528_REVERS-MOUNT  [TYR_WS2812B_3528_REVERS-MOUNT]
LED37  TYR_WS2812B_3528_REVERS-MOUNT  [TYR_WS2812B_3528_REVERS-MOUNT]
LED38  TYR_WS2812B_3528_REVERS-MOUNT  [TYR_WS2812B_3528_REVERS-MOUNT]
LED39  TYR_WS2812B_3528_REVERS-MOUNT  [TYR_WS2812B_3528_REVERS-MOUNT]
LED40  TYR_WS2812B_3528_REVERS-MOUNT  [TYR_WS2812B_3528_REVERS-MOUNT]
LED41  TYR_WS2812B_3528_REVERS-MOUNT  [TYR_WS2812B_3528_REVERS-MOUNT]

### Nets
GND: C10.1 C11.1 C12.1 C13.1 C14.1 C15.1 C16.1 C17.1 C18.1 C19.1 C20.1 C21.1 C22.1 C23.1 C24.1 C25.1 C26.1 C27.1 C28.1 C29.1 C30.1 C31.1 C32.1 C33.1 C34.1 C35.1 C36.1 C37.1 C38.1 C39.1 C40.1 C41.1 C42.1 C43.1 C44.1 LED1.GND LED2.GND LED3.GND LED4.GND LED5.GND LED6.GND LED7.GND LED8.GND LED9.GND LED10.GND LED11.GND LED12.GND LED13.GND LED14.GND LED15.GND LED16.GND LED17.GND LED18.GND LED19.GND LED20.GND LED21.GND LED22.GND LED23.GND LED24.GND LED25.GND LED26.GND LED27.GND LED28.GND LED29.GND LED30.GND LED31.GND LED32.GND LED33.GND LED34.GND LED35.GND LED36.GND LED37.GND LED38.GND LED39.GND LED40.GND LED41.GND ; supply symbol labelled SUPPLY2_GND ; also sheet 1,2
LED_DATA: LED41.DIN(DI) ; also sheet 1
LED_VCC: C10.2 C11.2 C12.2 C13.2 C14.2 C15.2 C16.2 C17.2 C18.2 C19.2 C20.2 C21.2 C22.2 C23.2 C24.2 C25.2 C26.2 C27.2 C28.2 C29.2 C30.2 C31.2 C32.2 C33.2 C34.2 C35.2 C36.2 C37.2 C38.2 C39.2 C40.2 C41.2 C42.2 C43.2 C44.2 LED1.VDD LED2.VDD LED3.VDD LED4.VDD LED5.VDD LED6.VDD LED7.VDD LED8.VDD LED9.VDD LED10.VDD LED11.VDD LED12.VDD LED13.VDD LED14.VDD LED15.VDD LED16.VDD LED17.VDD LED18.VDD LED19.VDD LED20.VDD LED21.VDD LED22.VDD LED23.VDD LED24.VDD LED25.VDD LED26.VDD LED27.VDD LED28.VDD LED29.VDD LED30.VDD LED31.VDD LED32.VDD LED33.VDD LED34.VDD LED35.VDD LED36.VDD LED37.VDD LED38.VDD LED39.VDD LED40.VDD LED41.VDD ; also sheet 1
N$9: LED40.DIN(DI) LED41.DOUT(DO)
N$30: LED39.DIN(DI) LED40.DOUT(DO)
N$51: LED38.DIN(DI) LED39.DOUT(DO)
N$52: LED37.DIN(DI) LED38.DOUT(DO)
N$53: LED36.DIN(DI) LED37.DOUT(DO)
N$54: LED35.DIN(DI) LED36.DOUT(DO)
N$55: LED34.DIN(DI) LED35.DOUT(DO)
N$56: LED33.DIN(DI) LED34.DOUT(DO)
N$57: LED32.DIN(DI) LED33.DOUT(DO)
N$58: LED31.DIN(DI) LED32.DOUT(DO)
N$59: LED30.DIN(DI) LED31.DOUT(DO)
N$60: LED29.DIN(DI) LED30.DOUT(DO)
N$61: LED28.DIN(DI) LED29.DOUT(DO)
N$62: LED27.DIN(DI) LED28.DOUT(DO)
N$63: LED26.DIN(DI) LED27.DOUT(DO)
N$64: LED25.DIN(DI) LED26.DOUT(DO)
N$65: LED24.DIN(DI) LED25.DOUT(DO)
N$66: LED23.DIN(DI) LED24.DOUT(DO)
N$67: LED22.DIN(DI) LED23.DOUT(DO)
N$68: LED21.DIN(DI) LED22.DOUT(DO)
N$69: LED20.DIN(DI) LED21.DOUT(DO)
N$70: LED19.DIN(DI) LED20.DOUT(DO)
N$71: LED18.DIN(DI) LED19.DOUT(DO)
N$72: LED17.DIN(DI) LED18.DOUT(DO)
N$73: LED16.DIN(DI) LED17.DOUT(DO)
N$74: LED15.DIN(DI) LED16.DOUT(DO)
N$75: LED14.DIN(DI) LED15.DOUT(DO)
N$76: LED13.DIN(DI) LED14.DOUT(DO)
N$77: LED12.DIN(DI) LED13.DOUT(DO)
N$78: LED11.DIN(DI) LED12.DOUT(DO)
N$79: LED10.DIN(DI) LED11.DOUT(DO)
N$80: LED9.DIN(DI) LED10.DOUT(DO)
N$81: LED8.DIN(DI) LED9.DOUT(DO)
N$82: LED7.DIN(DI) LED8.DOUT(DO)
N$83: LED6.DIN(DI) LED7.DOUT(DO)
N$84: LED5.DIN(DI) LED6.DOUT(DO)
N$85: LED4.DIN(DI) LED5.DOUT(DO)
N$86: LED3.DIN(DI) LED4.DOUT(DO)
N$87: LED2.DIN(DI) LED3.DOUT(DO)
N$88: LED1.DIN(DI) LED2.DOUT(DO)
Unconnected: LED1.DOUT(DO)

## Library data of the parts
1-6 A ALT B C CAPSLOCK CTRL D E ESC F F1-F6 FN G GRAVE H HOME INSERT Q R S T TAB V W WIN X Y Z = Tyr V4:KEYBOARD_KEYSWITCH-MX-1U-HOTSWAP
C1-C44 = Tyr V4:COMPONENTS_CAPACITOR
D1-D41 = Tyr V4:COMPONENTS_DIODE: Standard 1N4148 diode
HOLE1-HOLE6 = Tyr V4:HOLE_MOUNT_HOLE
J1 = Tyr V4:TYR_TYR_DISPLAY
LED1-LED41 = Tyr V4:TYR_WS2812B_3528_REVERS-MOUNT
R1-R4 R6-R10 = Tyr V4:COMPONENTS_RESISTOR
R5 = Tyr V4:MICROBUILDER_RESISTOR: Resistors 0402 - 0402 Surface Mount Package 22 Ohm 1% 1/16W [Digikey: 311-22.0LRTR-ND] 33 Ohm 5% 1/16W 1.0K 5% 1/16W 1.5K 5% 1/16W 2.0K 1% 1/16W 10.0K 1% 1/16W [Digikey: 311-10.0KLRTR-ND] 10.0K 5% 1/16W [Digikey: RMCF0402JT10K0TR-ND] 12.1K 1% 1/16W [Digikey: 311-22.0LRTR-ND] 100.0K 5% 1/16W 0603 - 0603 Surface Mount Package 0 Ohm 1/10 Watt 1% Resistor 15 Ohm 1/10 Watt 1% Resistor 33 Ohm 1/10 Watt 1% Resistor 49.9 Ohm 1/10 Watt 1% Resistor 100 Ohm 1/10 Watt 1% Resistor 150 Ohm 1/10 Watt 1% Resistor 240 Ohm 1/10 Watt 1% Resistor 390 Ohm 1/10 Watt 1% Resistor 560 Ohm 1/10 Watt 1% Resistor 680 Ohm 1/10 Watt 1% Resistor 750 Ohm 1/10 Watt 1% Resistor 1.0K Ohm 1/10 Watt 1% Resistor 1.5K Ohm 1/10 Watt 1% Resistor 2.0K Ohm 1/10 Watt 1% Resistor 2.2K Ohm 1/10 Watt 1% Resistor 3.3K Ohm 1/10 Watt 1% Resistor 4.7K Ohm 1/10 Watt 1% Resistor 10.0K Ohm 1/10 Watt 1% Resistor 12.0K Ohm 1/10 Watt 1% Resistor 12.1K Ohm 1/10 Watt 1% Resistor 20.0K Ohm 1/10 Watt 1% Resistor 33.0K Ohm 1/10 Watt 1% Resistor 100.0K Ohm 1/10 Watt 1% Resistor 0805 - 0805 Surface Mount Package 0 Ohm 1/8 Watt 1% Resistor 33 Ohm 1/8 Watt 1% Resistor 100 Ohm 1/8 Watt 1% Resistor 150 Ohm 1/8 Watt 1% Resistor 200 Ohm 1/8 Watt 1% Resistor 240 Ohm 1/8 Watt 1% Resistor 330 Ohm 1/8 Watt 1% Resistor 390 Ohm 1/8 Watt 1% Resistor 470 Ohm 1/8 Watt 1% Resistor 1.0K Ohm 1/8 Watt 1% Resistor 1.5K Ohm 1/8 Watt 1% Resistor 2.0K Ohm 1/8 Watt 1% Resistor 4.7K Ohm 1/8 Watt 1% Resistor 5.1K Ohm 1/8 Watt 1% Resistor 5.6K Ohm 1/8 Watt 1% Resistor 10.0K Ohm 1/8 Watt 1% Resistor 22.0K Ohm 1/8 Watt 1% Resistor 33.0K Ohm 1/8 Watt 1% Resistor 100K Ohm 1/8 Watt 1% Resistor 1206 - 1206 Surface Mount Package 2012 - 2010 Surface Mount Package 0.11 Ohm 1/2 Watt 1% Resistor - Digikey: RHM.11UCT-ND
SHIFT SPACE = Tyr V4:KEYBOARD_KEYSWITCH-MX-2U-HOTSWAP
SJ1 SJ2 = Tyr V4:MICROBUILDER_SOLDERJUMPER: SMD Solder JUMPER Solder the two pads together to create a connection, or remove the solder to break it. REFLOW - Use this footprint for solder paste and reflow ovens. WAVE - Use this footprint for hand-soldering (larger pads). CLOSED - Has a trace between the two pads to ensure it is closed by default. The trace needs to be cut to disable the jumper, and can be closed again by creating a solder bridge between the two pads.; BOM: EXCLUDE
U1 = Tyr V4:TYR_ATMEGA32U4
U2 = Tyr V4:CONTROLLER_PRTR5V0U2X
U3 = Tyr V4:MICROBUILDER_INA219: INA219 - I2C Current/Power Monitor Voltage Range: 0-26V Accuracy: 0.5% Temperature: -40°C - 125°C
U4 = Tyr V4:TYR_TPS2552
X1 = Tyr V4:CONTROLLER_USB-C-12P
Y1 = Tyr V4:CONTROLLER_CRYSTAL-4PIN